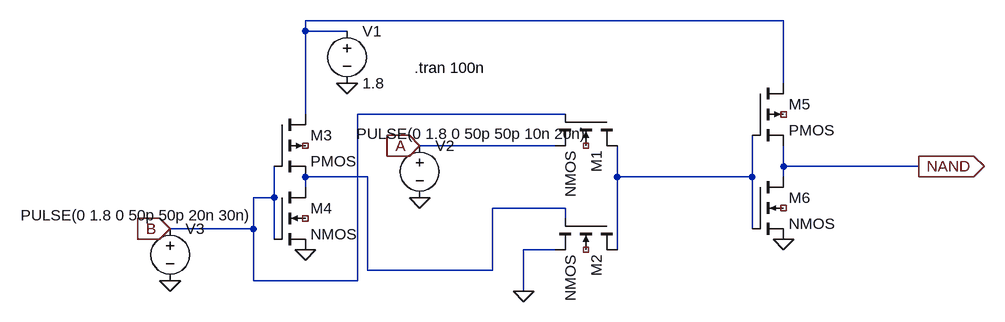
[diagram p0: schematic NAND.asc]
NAND.asc, the LTspice schematic file:
Version 4
SHEET 1 1124 680
WIRE 816 -96 80 -96
WIRE 80 -80 80 -96
WIRE 144 -80 80 -80
WIRE 816 0 816 -96
WIRE 80 48 80 -80
WIRE 480 48 160 48
WIRE 464 96 256 96
WIRE 816 128 816 96
WIRE 1024 128 816 128
WIRE 176 144 80 144
WIRE 560 144 560 96
WIRE 768 144 768 80
WIRE 768 144 560 144
WIRE 816 144 816 128
WIRE 80 160 80 144
WIRE 32 176 32 128
WIRE 32 176 0 176
WIRE 480 192 368 192
WIRE 480 208 480 192
WIRE 0 224 0 176
WIRE 0 224 -128 224
WIRE 768 224 768 144
WIRE 32 240 32 176
WIRE 464 256 416 256
WIRE 560 256 560 144
WIRE 176 288 176 144
WIRE 368 288 368 192
WIRE 368 288 176 288
WIRE 0 304 0 224
WIRE 160 304 160 48
WIRE 160 304 0 304
WIRE 416 320 416 256
FLAG 144 0 0
FLAG 416 320 0
FLAG 256 176 0
FLAG -128 304 0
FLAG 1024 128 NAND
IOPIN 1024 128 Out
FLAG 256 96 A
IOPIN 256 96 In
FLAG -128 224 B
IOPIN -128 224 In
FLAG 80 256 0
FLAG 816 240 0
SYMBOL nmos4 560 48 R90
SYMATTR InstName M1
SYMBOL nmos4 560 208 R90
SYMATTR InstName M2
SYMBOL pmos4 32 48 R0
SYMATTR InstName M3
SYMBOL nmos4 32 160 R0
SYMATTR InstName M4
SYMBOL voltage 144 -96 R0
WINDOW 123 0 0 Left 0
WINDOW 39 0 0 Left 0
SYMATTR InstName V1
SYMATTR Value 1.8
SYMBOL voltage 256 80 R0
WINDOW 3 -97 -2 Left 2
WINDOW 123 0 0 Left 0
WINDOW 39 0 0 Left 0
SYMATTR Value PULSE(0 1.8 0 50p 50p 10n 20n)
SYMATTR InstName V2
SYMBOL voltage -128 208 R0
WINDOW 3 -230 -5 Left 2
WINDOW 123 0 0 Left 0
WINDOW 39 0 0 Left 0
SYMATTR Value PULSE(0 1.8 0 50p 50p 20n 30n)
SYMATTR InstName V3
SYMBOL pmos4 768 0 R0
SYMATTR InstName M5
SYMBOL nmos4 768 144 R0
SYMATTR InstName M6
TEXT 248 -24 Left 2 !.tran 100n

The netlist it stands for:
* NAND.asc
M1 N003 B A NC_01 NMOS
M2 N003 N002 0 NC_02 NMOS
M3 N001 B N002 NC_03 PMOS
M4 N002 B 0 NC_04 NMOS
V1 N001 0 1.8
V2 A 0 PULSE(0 1.8 0 50p 50p 10n 20n)
V3 B 0 PULSE(0 1.8 0 50p 50p 20n 30n)
M5 N001 N003 NAND NC_05 PMOS
M6 NAND N003 0 NC_06 NMOS
.model NMOS NMOS
.model PMOS PMOS
.lib standard.mos
.tran 100n
.backanno
.end